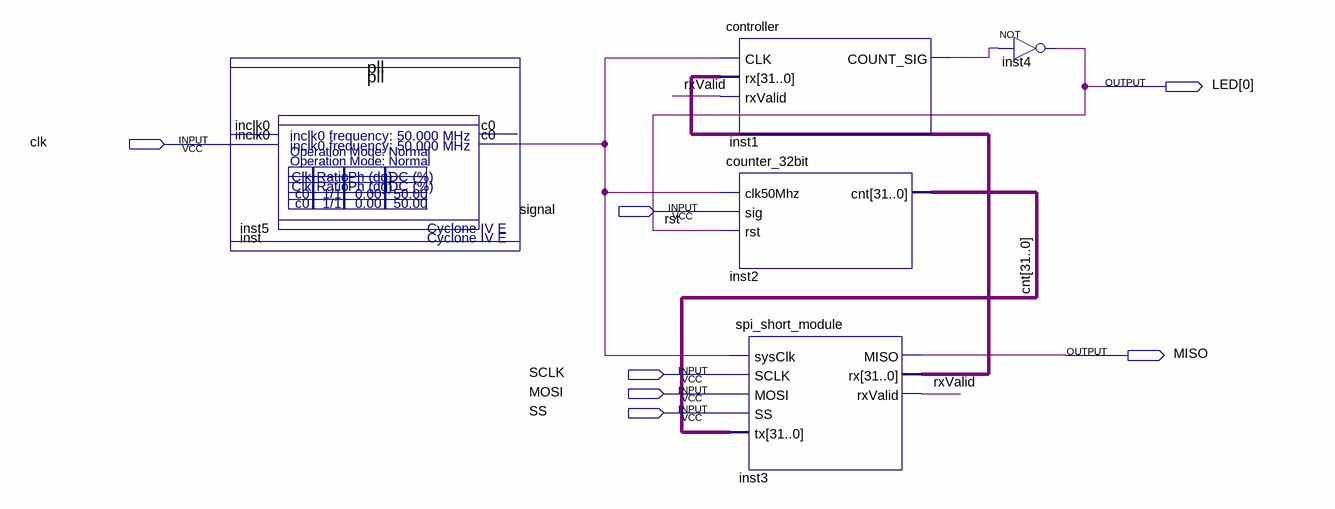
[diagram p0: schematic sheet]
// Quartus schematic simple_usb_counter.bdf as structural Verilog: 6 symbols, 7 pins
module simple_usb_counter (
  input  clk,
  input  signal,
  input  SCLK,
  input  MOSI,
  input  SS,
  output [0:0] LED,
  output MISO
);

  wire inst1_count_sig, inst_c0, rxValid;
  wire [31:0] cnt, inst3_rx;

  pll inst5 ();  // open: inclk0, c0
  pll inst (.inclk0(clk), .c0(inst_c0));
  controller inst1 (.CLK(inst_c0), .rx(inst3_rx), .rxValid(rxValid), .COUNT_SIG(inst1_count_sig));
  counter_32bit inst2 (.clk50Mhz(inst_c0), .sig(signal), .rst(LED[0]), .cnt(cnt));
  spi_short_module inst3 (
    .sysClk(inst_c0), .SCLK(SCLK), .MOSI(MOSI), .SS(SS), .tx(cnt), .MISO(MISO), .rx(inst3_rx),
    .rxValid(rxValid));
  not inst4 (LED[0], inst1_count_sig);

  // Other names for the same wires on the sheet: rst = LED[0]
endmodule
